# Altium schematic sheet Sheet1.SchDoc
size A4
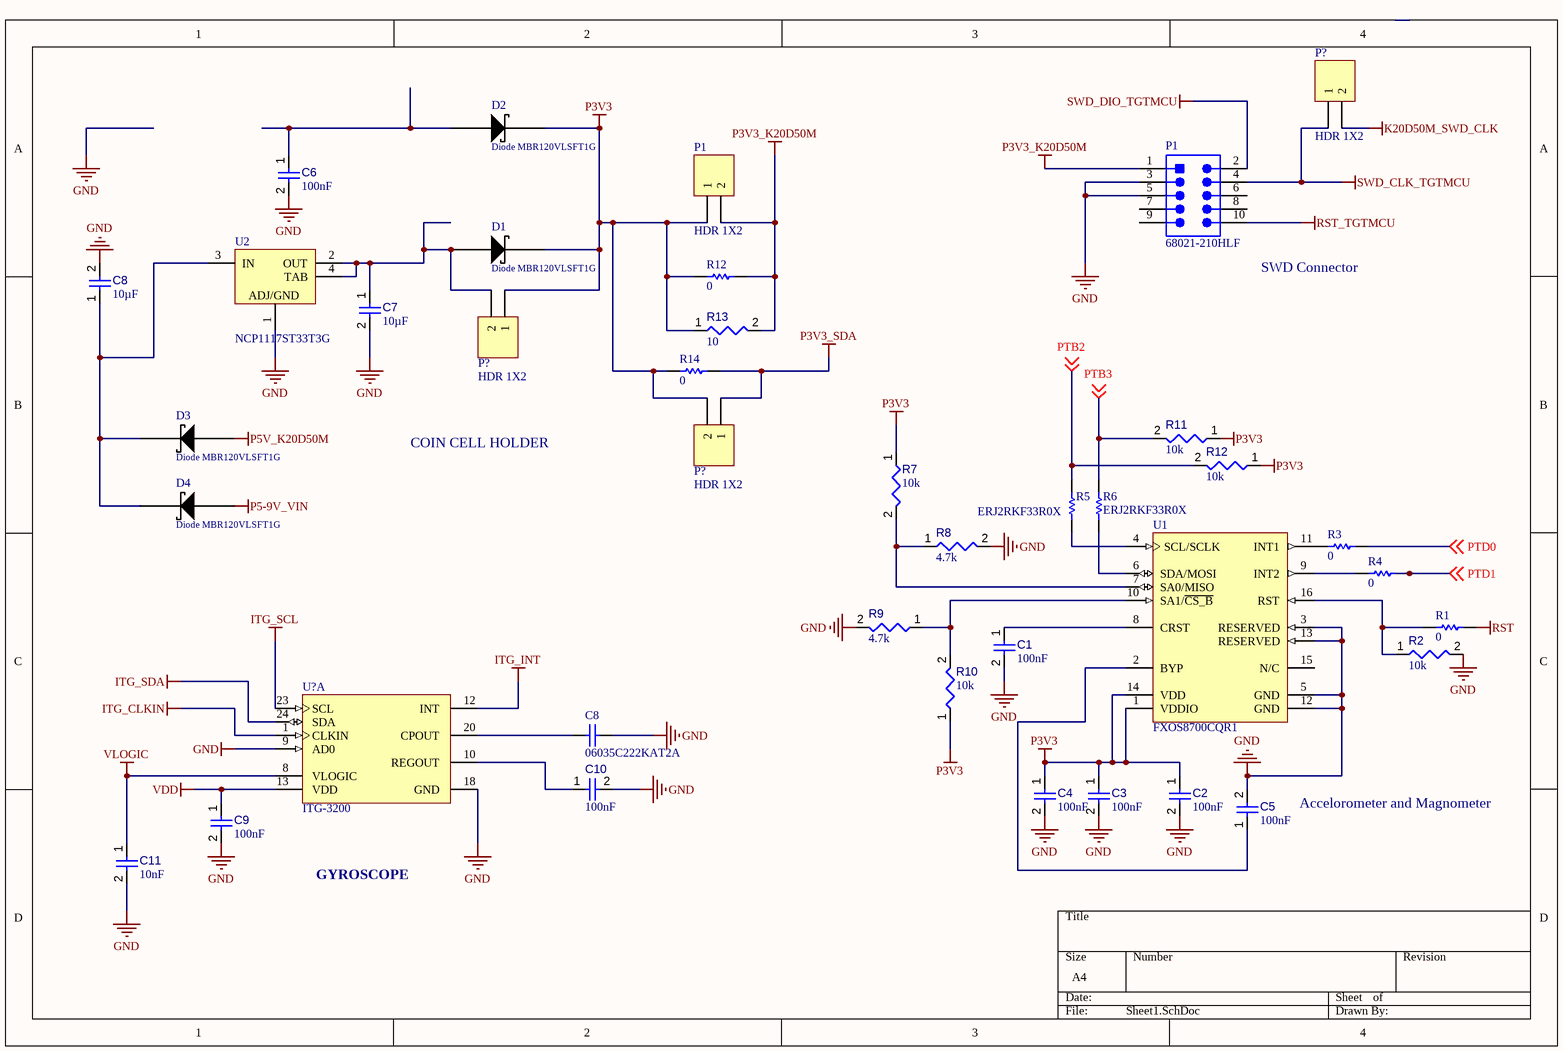
[diagram p0: Sheet1.SchDoc]

## Parts
(Parts that share a designator on the sheet are numbered #1, #2 ... from top to bottom, then left to right.)
C1  value 100nF  [CAPC1608X90X40ML10T20]  (hidden comment: Capacitor 100 nF +/-10% 50 V 0603)
C2  value 100nF  [CAPC1608X90X40ML10T20]  (hidden comment: Capacitor 100 nF +/-10% 50 V 0603)
C3  value 100nF  [CAPC1608X90X40ML10T20]  (hidden comment: Capacitor 100 nF +/-10% 50 V 0603)
C4  value 100nF  [CAPC1608X90X40ML10T20]  (hidden comment: Capacitor 100 nF +/-10% 50 V 0603)
C5  value 100nF  [CAPC1608X90X40ML10T20]  (hidden comment: Capacitor 100 nF +/-10% 50 V 0603)
C6  value 100nF  [CAPC1608X90X40ML10T20]  (hidden comment: Capacitor 100 nF +/-10% 50 V 0603)
C7  value 10µF  [CAPC0402(1005)60_L]  (hidden comment: Capacitor 10µF +/-40% 6.3V 0402)
C8#1  value 10µF  [CAPC0402(1005)60_L]  (hidden comment: Capacitor 10µF +/-40% 6.3V 0402)
C8#2  06035C222KAT2A  [CAPC1608X90X35ML15T15]
C9  value 100nF  [CAPC0402(1005)60_L]  (hidden comment: Capacitor 100nF +/-20% 50V 0402)
C10  value 100nF  [CAPC0402(1005)60_L]  (hidden comment: Capacitor 100nF +/-20% 50V 0402)
C11  value 10nF  [CAPC0402(1005)60_L]  (hidden comment: Capacitor 10nF +/-20% 50V 0402)
D1  Diode MBR120VLSFT1G  [SODFL360X100-2N]
D2  Diode MBR120VLSFT1G  [SODFL360X100-2N]
D3  Diode MBR120VLSFT1G  [SODFL360X100-2N]
D4  Diode MBR120VLSFT1G  [SODFL360X100-2N]
P1#1  68021-210HLF  [FCI-68021-210HLF-10_V]
P1#2  HDR 1X2  [HDR1X2]
P?#1  HDR 1X2  [HDR1X2]
P?#2  HDR 1X2  [HDR1X2]
P?#3  HDR 1X2  [HDR1X2]
R1  value 0  [RESC1005X40X25ML05T05]  (hidden comment: Resistor 0R +/- 5% 0402 100 mW)
R2  value 10k  [RESC1005X40X25ML05T05]  (hidden comment: Resistor 10k +/-1% 0402 63 mW)
R3  value 0  [RESC1005X40X25ML05T05]  (hidden comment: Resistor 0R +/- 5% 0402 100 mW)
R4  value 0  [RESC1005X40X25ML05T05]  (hidden comment: Resistor 0R +/- 5% 0402 100 mW)
R5  ERJ2RKF33R0X  [RESC1005X40X25LL05T05]
R6  ERJ2RKF33R0X  [RESC1005X40X25LL05T05]
R7  value 10k  [RESC1005X40X25ML05T05]  (hidden comment: Resistor 10k +/-1% 0402 63 mW)
R8  value 4.7k  [RESC1608X55X25ML10T15]  (hidden comment: Resistor 4k7 +/-1% 0603 100 mW)
R9  value 4.7k  [RESC1608X55X25ML10T15]  (hidden comment: Resistor 4k7 +/-1% 0603 100 mW)
R10  value 10k  [RESC1005X40X25ML05T05]  (hidden comment: Resistor 10k +/-1% 0402 63 mW)
R11  value 10k  [RESC1005X40X25ML05T05]  (hidden comment: Resistor 10k +/-1% 0402 63 mW)
R12#1  value 0  [RESC1005X40X25ML05T05]  (hidden comment: Resistor 0R +/- 5% 0402 100 mW)
R12#2  value 10k  [RESC1005X40X25ML05T05]  (hidden comment: Resistor 10k +/-1% 0402 63 mW)
R13  value 10  [RESC0402(1005)_L]  (hidden comment: Resistor 10R  +/-1 % 0402 63 mW)
R14  value 0  [RESC1005X40X25ML05T05]  (hidden comment: Resistor 0R +/- 5% 0402 100 mW)
U1  FXOS8700CQR1  [FREE-QFN-16-3000X3000DE_V]
U2  NCP1117ST33T3G  [ONSC-SOT-223-4-318H-01_A_V]
U?  ITG-3200  [INSE-QFN-24_A_M]  (part A of 2)

## Nets
GND: C1.2 C2.2 C3.2 C4.2 C5.2 C6.2 C7.2 C8#1.2 C8#2.2 C9.2 C10.2 C11.2 P1#1.3 P1#1.5 R2.2 R8.2 R9.2 U1.3(RESERVED) U1.5(GND) U1.12(GND) U1.13(RESERVED) U2.1(ADJ/GND) U?.9(AD0) U?.18(GND)
ITG_CLKIN: U?.1(CLKIN)
ITG_INT: U?.12(INT)
ITG_SCL: U?.23(SCL)
ITG_SDA: U?.24(SDA)
K20D50M_SWD_CLK: P?#1.2
P3V3: C2.1 C3.1 C4.1 D1.1 D2.1 P1#2.1 P?#2.1 P?#3.2 R7.1 R10.1 R11.1 R12#1.1 R12#2.1 R13.1 R14.1 U1.1(VDDIO) U1.14(VDD)
P3V3_K20D50M: P1#1.1 P1#2.2 R12#1.2 R13.2
P3V3_SDA: P?#3.1 R14.2
P5-9V_VIN: D4.2
P5V_K20D50M: D3.2
RST: R1.2
RST_TGTMCU: P1#1.10
SWD_CLK_TGTMCU: P1#1.4 P?#1.1
SWD_DIO_TGTMCU: P1#1.2
VDD: C9.1 U?.13(VDD)
VLOGIC: C11.1 U?.8(VLOGIC)
PTB2: R5.2 R12#2.2 ; off-sheet PTB2
PTB3: R6.2 R11.2 ; off-sheet PTB3
PTD0: R3.2 ; off-sheet PTD0
PTD1: R4.2 ; off-sheet PTD1
NetC1_1: C1.1 U1.8(CRST)
NetC5_1: C5.1 U1.2(BYP)
NetC6_1: C6.1 D2.2
NetC7_1: C7.1 D1.2 P?#2.2 U2.2(OUT) U2.4(TAB)
NetC8#1_1: C8#1.1 D3.1 D4.1 U2.3(IN)
NetC8#2_1: C8#2.1 U?.20(CPOUT)
NetC10_1: C10.1 U?.10(REGOUT)
NetR1_1: R1.1 R2.1 U1.16(RST)
NetR3_1: R3.1 U1.11(INT1)
NetR4_1: R4.1 U1.9(INT2)
NetR5_1: R5.1 U1.4(SCL/SCLK)
NetR6_1: R6.1 U1.6(SDA/MOSI)
NetR7_2: R7.2 R8.1 U1.7(SA0/MISO)
NetR9_1: R9.1 R10.2 U1.10(SA1/~{CS_B})

Not connected (* = marked no-connect by the designer): P1#1 6 7 8 9; U1 15(N/C)

## Notes on the sheet
- SWD Connector
- COIN CELL HOLDER
- (near C5) Accelorometer and Magnometer
- GYROSCOPE

## Library data of the parts
C1-C6 = CMP-001-00017-4: Chip Capacitor, 100 nF, +/- 10%, 50 V, 0603 (1608 Metric); Capacitor Type: Ceramic; Voltage Rating: 50V; RoHS Compliant: True; Max Operating Temperature: 125°C; Pins: 2; Mounting Technology: SM; Min Operating Temperature: -55°C; Tolerance: 10%; Case/Package: 0603
C7 C8#1 = CMP-001-00074-2: Chip Capacitor, 10µF +/-40%, 6.3V, 0402, Thickness 0.6 mm; Tolerance: 10%; Max Operating Temperature: 85°C; Pins: 2; Case/Package: 0402; Min Operating Temperature: -55°C; Voltage Rating: 6.3V; Mounting Technology: SMT
C8#2 = CMP-2006-04409-1: Manufacturer: AVX Interconnect / Elco; Part Number: 06035C222KAT2A
C9 C10 = CMP-001-00067-2: Chip Capacitor, 100nF +/-20%, 50V, 0402, Thickness 0.6 mm; Tolerance: 10%; Mounting Technology: SMT; Min Operating Temperature: -55°C; Pins: 2; Case/Package: 0402; Voltage Rating: 50V; Max Operating Temperature: 85°C
C11 = CMP-001-00069-2: Chip Capacitor, 10nF +/-20%, 50V, 0402, Thickness 0.6 mm; Tolerance: 5%; Voltage Rating: 50V; Pins: 2; Max Operating Temperature: 85°C; Mounting Technology: SMT; Min Operating Temperature: -55°C; Case/Package: 0402
D1-D4 = CMP-007-0001-1: MBR120VLSFT1G Schottky Rectifier, 20V, 1A; Component Type: Standard; Pins: 2; Design Item ID: Diode MBR120VLSFT1G; Source: JCULibrary.SchLib
P1#1 = CMP-002-00020-1: Male Header, Pitch 2.54 mm, 2 x 5 Position, Height 4.83 mm, Tail Length 3.05 mm, Bulk; Manufacturer: FCI Electronics; Package Reference: 68021-210HLF-10; Datasheet URL: http://portal.fciconnect.com/Comergent//fci/drawing/68020.pdf; Gender: Male; Manufacturer URL: http://portal.fciconnect.com/; Mounting Technology: TH; Case/Package: 68021-210HLF-10; RoHS Compliant: Unknown; Package Description: Male Header, Pitch 2.54 mm, 2 x 5 Position, Height 4.83 mm, Tail Length 3.05 mm; Connector Type: Header; Datasheet Version: Rev. BM, 04/2015
P1#2 P?#1-P?#3 = Header 2: Header, 2-Pin; LatestRevisionDate: 17-Jul-2002; LatestRevisionNote: Re-released for DXP Platform.; Publisher: Altium Limited
R1 R3 R4 R12#1 R14 = CMP-009-00005-4: Chip Resistor, 0 Ohm, 0.1 W, -55 to 155 degC, 0402 (1005 Metric); Voltage Rating: 50V; Power: 100mW; Max Operating Temperature: 155°C; Tolerance: 5%; RoHS Compliant: True; Pins: 2; Case/Package: 0402; Min Operating Temperature: -55°C; Mounting Technology: SM
R2 R7 R10 R11 R12#2 = CMP-009-00019-4: Chip Resistor, 10 KOhm, +/- 1%, 63 mW, -55 to 155 degC, 0402 (1005 Metric); Voltage Rating: 50V; Power: 63mW; Case/Package: 0402; Max Operating Temperature: 155°C; Mounting Technology: SM; RoHS Compliant: True; Pins: 2; Min Operating Temperature: -55°C; Tolerance: 1%
R5 R6 = CMP-2002-01146-1: Manufacturer: Panasonic; Part Number: ERJ2RKF33R0X
R8 R9 = CMP-009-00031-4: Chip Resistor, 4.7 KOhm, +/- 1%, 0.1 W, -55 to 155 degC, 0603 (1608 Metric); Power: 100mW; Max Operating Temperature: 155°C; Tolerance: 1%; Mounting Technology: SM; RoHS Compliant: True; Pins: 2; Case/Package: 0603; Min Operating Temperature: -55°C
R13 = CMP-009-00152-2: Chip Resistor, 10 Ohms, +/-1 %, 63 mW, -55 to 155 degC, 0402; Power: 63mW; Tolerance: 1%; Min Operating Temperature: -55°C; Pins: 2; Max Operating Temperature: 155°C; Case/Package: 0402
U1 = CMP-2000-05129-1: 6-Axis Xtrinsic Sensor with Integrated Linear Accelerometer and Magnetometer, 1.95 to 3.6 V, -40 to 85 degC, 16-Pin QFN, RoHS, Tape and Reel; Manufacturer: Freescale; Supply Voltage - Min: 1.95V; Operating Supply Voltage: 1.95Vto3.6V; Unit Weight: 0.000808oz; Supply Voltage - Max: 3.6V; Brand: FreescaleSemiconductor; Sensing Axis: X,Y,Z; Output Type: Digital; Package / Case: QFN-16; Datasheet Version: Rev. 1, 06/2012; Factory Pack Quantity: 1000; Mounting Style: SMD/SMT; Datasheet URL: https://datasheet.ciiva.com/12175/fxos8700cq-60595-12175213.pdf; Type: 6AxisSensor; Maximum Operating Temperature: +85C; Manufacturer URL: http://www.nxp.com/; Package Description: 16-Pin Quad Flat No-lead Package, Body 3 x 3 mm, Pitch 0.5 mm; RoHS: Details; Package Reference: QFN-16; Tradename: Xtrinsic; Packaging: Reel; Minimum Operating Temperature: -40C; Product Category: BoardMountAccelerationSensors
U2 = CMP-019-00030-2: Low-Dropout Positive Fixed Voltage Regulator, 1 A, 3.3 V Output Voltage, 0 to 125 degC, 4-Pin SOT-223 (318H-01), Pb-Free, Tape and Reel; Manufacturer: ON Semiconductor; Nominal Output Voltage: 3.3V; Min Supply Voltage: 4.75V; Outputs: 1; Max Ouput Current: 1A; Dropout Voltage: 1.1V; Max Supply Voltage: 15V; Max Input Voltage: 20V; Min Input Voltage: 3.5V; Package Description: 4-Pin Small Outline Transistor, Body 6.5 x 3.5 mm, Pitch 2.3 mm; Datasheet Version: Rev. 27, 09/2014; Package Quantity: 4000; Mounting Technology: SM; Datasheet URL: http://www.onsemi.com/pub_link/Collateral/NCP1117-D.PDF; Output Voltage: 3.3V; Manufacturer URL: http://www.onsemi.com/; Output Current: 1A; Min Operating Temperature: 0°C; Package Reference: SOT-223-4-318H-01_A; Max Operating Temperature: 125°C; Pins: 3; Packaging: TapeandReel; Case/Package: SOT-223-4; RoHS Compliant: True
U? = CMP-010-00010-2: Single-Chip, Digital-Output, MEMS Gyroscope, 2.1 to 3.6 V, -40 to 105 degC, 24 -Pin QFN, RoHS, Tape and Reel; Manufacturer: InvenSense; Min Supply Voltage: 2.1V; Interface: Serial; Max Supply Voltage: 3.6V; Pins: 24; Min Operating Temperature: -40°C; Datasheet URL: http://www.farnell.com/datasheets/887152.pdf; RoHS Compliant: True; Mounting Technology: SM; Datasheet Version: Rev. 1.4, 03/2010; Max Operating Temperature: 85°C; Packaging: CutTape; Package Reference: QFN-24_A; Package Description: 24-Pin Quad Flat No-lead Package, Body 4.00 x 4.00 mm, Pitch 0.50 mm, Thermal Pad 3.00 x 2.80 mm; Case/Package: QFN